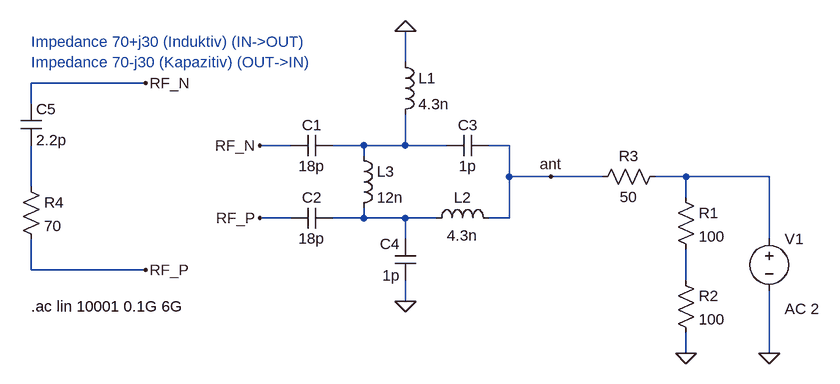
[diagram p0: schematic Antenne_2.4GHz_Serie.asc]
Antenne_2.4GHz_Serie.asc, the LTspice schematic file:
Version 4
SHEET 1 880 680
WIRE -80 -208 -80 -256
WIRE -480 -176 -656 -176
WIRE -656 -144 -656 -176
WIRE -256 -80 -304 -80
WIRE -144 -80 -192 -80
WIRE -80 -80 -80 -128
WIRE -80 -80 -144 -80
WIRE -16 -80 -80 -80
WIRE 80 -80 48 -80
WIRE -144 -64 -144 -80
WIRE 80 -32 80 -80
WIRE 144 -32 80 -32
WIRE 224 -32 144 -32
WIRE 352 -32 304 -32
WIRE 480 -32 352 -32
WIRE -656 -16 -656 -80
WIRE 352 0 352 -32
WIRE -256 32 -304 32
WIRE -144 32 -144 16
WIRE -144 32 -192 32
WIRE -80 32 -144 32
WIRE -32 32 -80 32
WIRE 80 32 80 -32
WIRE 80 32 48 32
WIRE -80 64 -80 32
WIRE 480 64 480 -32
WIRE -656 112 -656 64
WIRE -480 112 -656 112
WIRE 352 128 352 80
WIRE -80 160 -80 128
WIRE 352 240 352 208
WIRE 480 240 480 144
FLAG -80 -256 0
FLAG -304 -80 RF_N
FLAG -304 32 RF_P
FLAG 144 -32 ant
FLAG -480 -176 RF_N
FLAG -480 112 RF_P
FLAG -80 160 0
FLAG 352 240 0
FLAG 480 240 0
SYMBOL cap -192 -96 R90
WINDOW 0 0 32 VBottom 2
WINDOW 3 32 32 VTop 2
SYMATTR InstName C1
SYMATTR Value 18p
SYMBOL cap -192 16 R90
WINDOW 0 0 32 VBottom 2
WINDOW 3 32 32 VTop 2
SYMATTR InstName C2
SYMATTR Value 18p
SYMBOL cap 48 -96 R90
WINDOW 0 0 32 VBottom 2
WINDOW 3 32 32 VTop 2
SYMATTR InstName C3
SYMATTR Value 1p
SYMBOL ind -96 -224 R0
SYMATTR InstName L1
SYMATTR Value 4.3n
SYMBOL ind -48 48 R270
WINDOW 0 32 56 VTop 2
WINDOW 3 5 56 VBottom 2
SYMATTR InstName L2
SYMATTR Value 4.3n
SYMBOL cap -64 128 R180
WINDOW 0 24 56 Left 2
WINDOW 3 24 8 Left 2
SYMATTR InstName C4
SYMATTR Value 1p
SYMBOL cap -672 -144 R0
SYMATTR InstName C5
SYMATTR Value 2.2p
SYMBOL res 336 -16 R0
SYMATTR InstName R1
SYMATTR Value 100
SYMBOL res 336 112 R0
SYMATTR InstName R2
SYMATTR Value 100
SYMBOL voltage 480 48 R0
WINDOW 123 24 124 Left 2
WINDOW 39 0 0 Left 2
SYMATTR Value2 AC 2
SYMATTR InstName V1
SYMATTR Value ""
SYMBOL res 320 -48 R90
WINDOW 0 0 56 VBottom 2
WINDOW 3 32 56 VTop 2
SYMATTR InstName R3
SYMATTR Value 50
SYMBOL res -672 -32 R0
SYMATTR InstName R4
SYMATTR Value 70
SYMBOL ind -160 -80 R0
SYMATTR InstName L3
SYMATTR Value 12n
TEXT -656 168 Left 2 !.ac lin 10001 0.1G 6G
TEXT -656 -240 Left 2 ;Impedance 70+j30 (Induktiv) (IN->OUT)
TEXT -656 -208 Left 2 ;Impedance 70-j30 (Kapazitiv) (OUT->IN)

The netlist it stands for:
* Antenne_2.4GHz_Serie.asc
C1 N001 RF_N 18p
C2 N004 RF_P 18p
C3 ant N001 1p
L1 0 N001 4.3n
L2 N004 ant 4.3n
C4 0 N004 1p
C5 RF_N N003 2.2p
R1 N002 N005 100
R2 N005 0 100
V1 N002 0 AC 2
R3 N002 ant 50
R4 N003 RF_P 70
L3 N001 N004 12n
.ac lin 10001 0.1G 6G
* Impedance 70+j30 (Induktiv) (IN->OUT)
* Impedance 70-j30 (Kapazitiv) (OUT->IN)
.backanno
.end